# EAGLE design General IO (EAGLE 4.13)
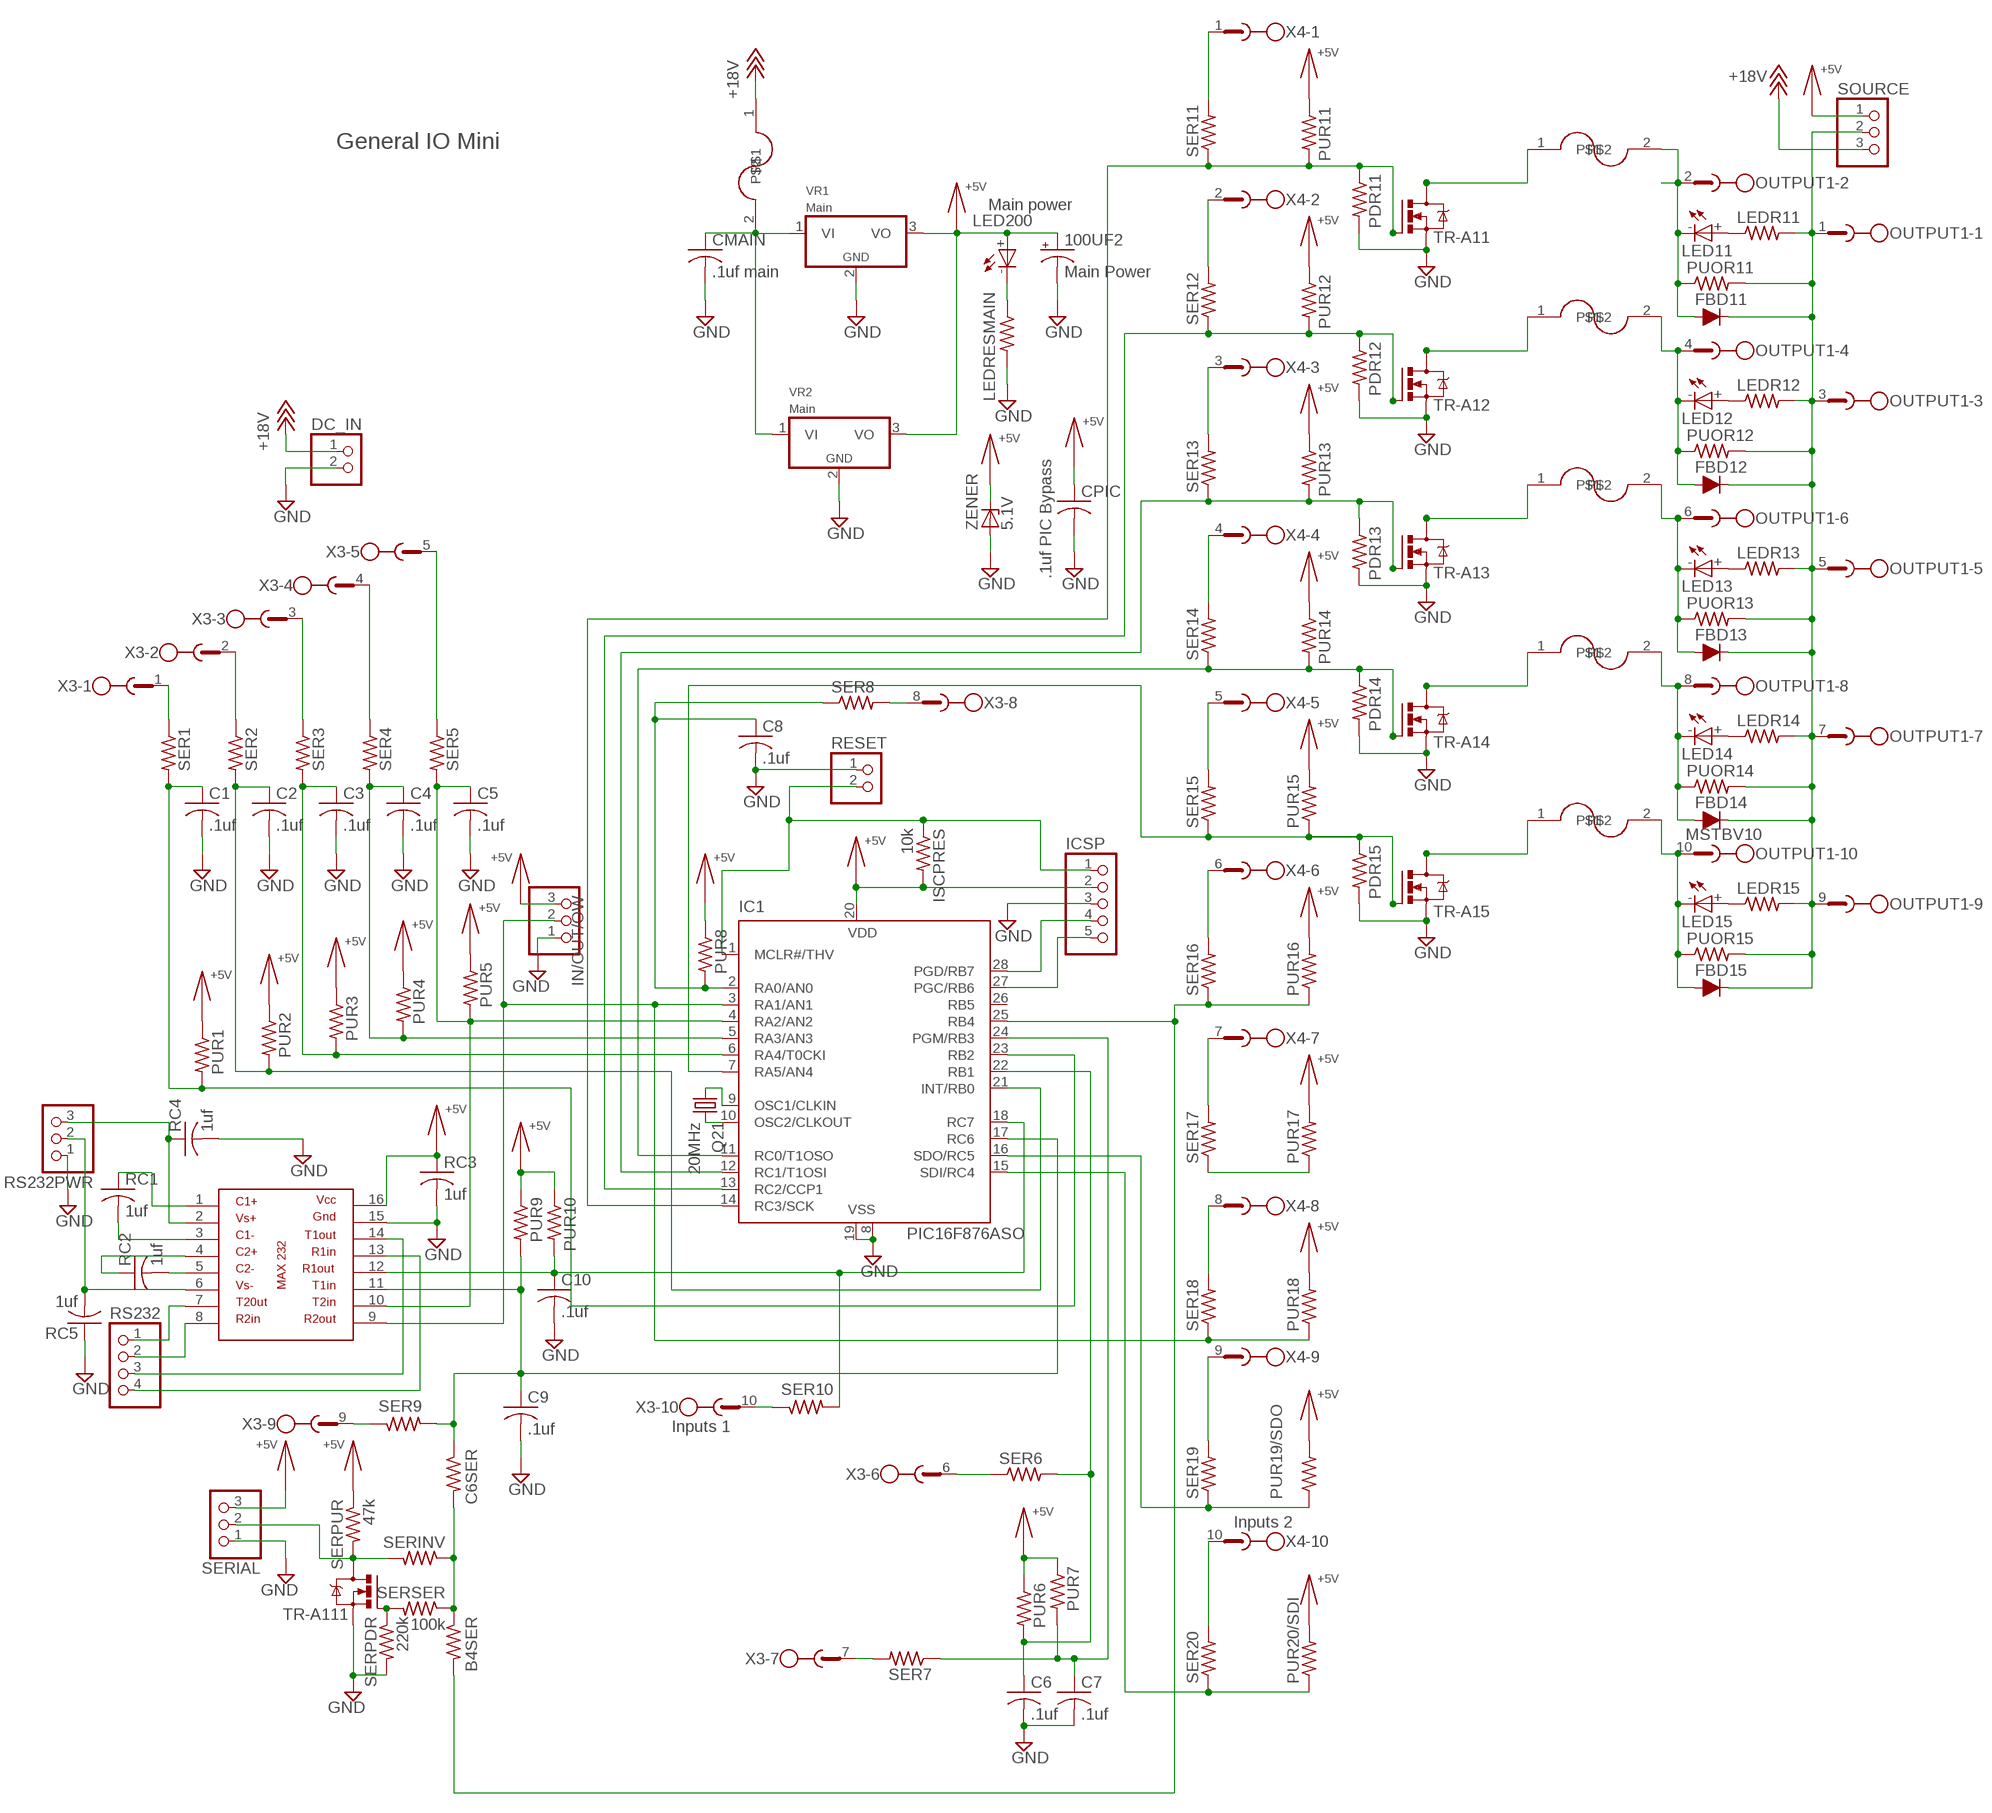
[diagram p0: schematic, sheet 1]

## Parts
100UF2  Main Power  CAPACITOR-ELECTROLYTICG  [PANASONIC_G]
B4SER  RESISITORM1406  [M1406]
C1  .1uf  CAPACITOR-NO-POLARITYC1210  [C1210]
C2  .1uf  CAPACITOR-NO-POLARITYC1210  [C1210]
C3  .1uf  CAPACITOR-NO-POLARITYC1210  [C1210]
C4  .1uf  CAPACITOR-NO-POLARITYC1210  [C1210]
C5  .1uf  CAPACITOR-NO-POLARITYC1210  [C1210]
C6  .1uf  CAPACITOR-NO-POLARITYC1210  [C1210]
C6SER  RESISITORM1406  [M1406]
C7  .1uf  CAPACITOR-NO-POLARITYC1210  [C1210]
C8  .1uf  CAPACITOR-NO-POLARITYC1210  [C1210]
C9  .1uf  CAPACITOR-NO-POLARITYC1210  [C1210]
C10  .1uf  CAPACITOR-NO-POLARITYC1210  [C1210]
CMAIN  .1uf main  CAPACITOR-NO-POLARITYC1210  [C1210]
CPIC  .1uf PIC Bypass  CAPACITOR-NO-POLARITYC1210  [C1210]
DC_IN  PINHD-1X2  [1X02]
FBD11  D-FILL-SOD-87  [SOD87]
FBD12  D-FILL-SOD-87  [SOD87]
FBD13  D-FILL-SOD-87  [SOD87]
FBD14  D-FILL-SOD-87  [SOD87]
FBD15  D-FILL-SOD-87  [SOD87]
IC1  PIC16F876ASO  PIC16F876SO  [SO-28W]
ICSP  PINHD-1X5  [1X05]
IN/OUT/OW  PINHD-1X3  [1X03]
ISCPRES  10k  RESISITORM1406  [M1406]
LED11  LED  [1206]
LED12  LED  [1206]
LED13  LED  [1206]
LED14  LED  [1206]
LED15  LED  [1206]
LED200  Main power  LED  [1206]
LEDR11  RESISITORM1406  [M1406]
LEDR12  RESISITORM1406  [M1406]
LEDR13  RESISITORM1406  [M1406]
LEDR14  RESISITORM1406  [M1406]
LEDR15  RESISITORM1406  [M1406]
LEDRESMAIN  RESISITORR1210  [R1210]
OUTPUT1  MSTBV10  [MSTBV10]
PDR11  RESISITORM1406  [M1406]
PDR12  RESISITORM1406  [M1406]
PDR13  RESISITORM1406  [M1406]
PDR14  RESISITORM1406  [M1406]
PDR15  RESISITORM1406  [M1406]
POLYFUSE11  POLYFUSE  [0204/5]
POLYFUSE12  POLYFUSE  [0204/5]
POLYFUSE13  POLYFUSE  [0204/5]
POLYFUSE14  POLYFUSE  [0204/5]
POLYFUSE15  POLYFUSE  [0204/5]
POLYFUSE200  Main power  POLYFUSE  [0204/5]
PUOR11  RESISITORM1406  [M1406]
PUOR12  RESISITORM1406  [M1406]
PUOR13  RESISITORM1406  [M1406]
PUOR14  RESISITORM1406  [M1406]
PUOR15  RESISITORM1406  [M1406]
PUR1  RESISITORM1406  [M1406]
PUR2  RESISITORM1406  [M1406]
PUR3  RESISITORM1406  [M1406]
PUR4  RESISITORM1406  [M1406]
PUR5  RESISITORM1406  [M1406]
PUR6  RESISITORM1406  [M1406]
PUR7  RESISITORM1406  [M1406]
PUR8  RESISITORM1406  [M1406]
PUR9  RESISITORM1406  [M1406]
PUR10  RESISITORM1406  [M1406]
PUR11  RESISITORM1406  [M1406]
PUR12  RESISITORM1406  [M1406]
PUR13  RESISITORM1406  [M1406]
PUR14  RESISITORM1406  [M1406]
PUR15  RESISITORM1406  [M1406]
PUR16  RESISITORM1406  [M1406]
PUR17  RESISITORM1406  [M1406]
PUR18  RESISITORM1406  [M1406]
PUR19/SDO  RESISITORM1406  [M1406]
PUR20/SDI  RESISITORM1406  [M1406]
Q21  20MHz  CRYSTALSM49  [SM49]
RC1  1uf  CAPACITOR-NO-POLARITYC1210  [C1210]
RC2  1uf  CAPACITOR-NO-POLARITYC1210  [C1210]
RC3  1uf  CAPACITOR-NO-POLARITYC1210  [C1210]
RC4  1uf  CAPACITOR-NO-POLARITYC1210  [C1210]
RC5  1uf  CAPACITOR-NO-POLARITYC1210  [C1210]
RESET  PINHD-1X2  [1X02]
RS232  PINHD-1X4  [1X04]
RS232PWR  PINHD-1X3  [1X03]
SER1  RESISITORM1406  [M1406]
SER2  RESISITORM1406  [M1406]
SER3  RESISITORM1406  [M1406]
SER4  RESISITORM1406  [M1406]
SER5  RESISITORM1406  [M1406]
SER6  RESISITORM1406  [M1406]
SER7  RESISITORM1406  [M1406]
SER8  RESISITORM1406  [M1406]
SER9  RESISITORM1406  [M1406]
SER10  RESISITORM1406  [M1406]
SER11  RESISITORM1406  [M1406]
SER12  RESISITORM1406  [M1406]
SER13  RESISITORM1406  [M1406]
SER14  RESISITORM1406  [M1406]
SER15  RESISITORM1406  [M1406]
SER16  RESISITORM1406  [M1406]
SER17  RESISITORM1406  [M1406]
SER18  RESISITORM1406  [M1406]
SER19  RESISITORM1406  [M1406]
SER20  RESISITORM1406  [M1406]
SERIAL  PINHD-1X3  [1X03]
SERINV  RESISITORM1406  [M1406]
SERPDR  220k  RESISITORM1406  [M1406]
SERPUR  47k  RESISITORM1406  [M1406]
SERSER  100k  RESISITORM1406  [M1406]
SOURCE  PINHD-1X3  [1X03]
TR-A11  ZXMN10A08GSOT223  [SOT223R_INFINEON]
TR-A12  ZXMN10A08GSOT223  [SOT223R_INFINEON]
TR-A13  ZXMN10A08GSOT223  [SOT223R_INFINEON]
TR-A14  ZXMN10A08GSOT223  [SOT223R_INFINEON]
TR-A15  ZXMN10A08GSOT223  [SOT223R_INFINEON]
TR-A111  ZXMN10A08GSOT223  [SOT223R_INFINEON]
U$1  MAX232  [SO16]
VR1  Main  VOLTAGE-REGULATOR  [TO220S]
VR2  Main  VOLTAGE-REGULATORSO-223  [SOT223R_INFINEON]
X3  Inputs 1  MSTBV10  [MSTBV10]
X4  Inputs 2  MSTBV10  [MSTBV10]
ZENER  5.1V  ZENER-DIODESMB  [SMB]

## Nets
$N199: IC1.15(SDI/RC4) PUR20/SDI.1 SER20.1
+5V: 100UF2.+ CPIC.1 IC1.20(VDD) ICSP.2 IN/OUT/OW.3 ISCPRES.2 LED200.+ PUR1.1 PUR2.1 PUR3.1 PUR4.1 PUR5.1 PUR6.1 PUR7.1 PUR8.1 PUR9.1 PUR10.1 PUR11.1 PUR12.1 PUR13.1 PUR14.1 PUR15.2 PUR16.2 PUR17.2 PUR18.2 PUR19/SDO.2 PUR20/SDI.2 RC3.1 SERIAL.3 SERPUR.1 SOURCE.1 U$1.16 VR1.3(VO) VR2.3(VO) ZENER.C
+18V: DC_IN.1 POLYFUSE200.1 SOURCE.3
GND: 100UF2.- C1.2 C2.2 C3.2 C4.2 C5.2 C6.2 C7.2 C8.2 C9.2 C10.2 CMAIN.2 CPIC.2 DC_IN.2 IC1.8(VSS) IC1.19(VSS) ICSP.3 IN/OUT/OW.1 LEDRESMAIN.2 PDR11.2 PDR12.2 PDR13.2 PDR14.2 PDR15.2 RC3.2 RC4.2 RC5.1 RESET.1 RS232PWR.1 SERIAL.1 SERPDR.2 TR-A11.3(S) TR-A12.3(S) TR-A13.3(S) TR-A14.3(S) TR-A15.3(S) TR-A111.3(S) U$1.15 VR1.2(GND) VR2.2(GND) ZENER.A
N$1: SER20.2 X4.10
N$3: SER17.2 X4.7
N$8: PUR17.1 SER17.1
N$11: IC1.16(SDO/RC5) PUR19/SDO.1 SER19.1
N$12: C8.1 IC1.2(RA0/AN0) PUR8.2 SER8.1
N$15: C2.1 IC1.21(INT/RB0) PUR2.2 SER2.2
N$16: FBD12.2(A) LED12.- OUTPUT1.4 POLYFUSE12.2 PUOR12.1
N$17: POLYFUSE15.1 TR-A15.2(D)
N$18: FBD15.2(A) LED15.- OUTPUT1.10 POLYFUSE15.2 PUOR15.1
N$19: RS232.1 U$1.7
N$20: SER16.2 X4.6
N$21: POLYFUSE14.1 TR-A14.2(D)
N$22: FBD14.2(A) LED14.- OUTPUT1.8 POLYFUSE14.2 PUOR14.1
N$23: POLYFUSE13.1 TR-A13.2(D)
N$24: FBD13.2(A) LED13.- OUTPUT1.6 POLYFUSE13.2 PUOR13.1
N$25: SER14.2 X4.4
N$26: SER12.2 X4.2
N$27: POLYFUSE12.1 TR-A12.2(D)
N$28: SER13.2 X4.3
N$29: POLYFUSE11.1 TR-A11.2(D)
N$30: FBD11.2(A) LED11.- OUTPUT1.2 POLYFUSE11.2 PUOR11.1
N$31: IC1.28(PGD/RB7) ICSP.4
N$32: SER15.2 X4.5
N$33: C1.1 IC1.23(RB2) PUR1.2 SER1.2
N$35: IC1.10(OSC2/CLKOUT) Q21.2
N$36: SERPDR.1 SERSER.2 TR-A111.1(G)
N$37: IC1.1(MCLR#/THV) ICSP.1 ISCPRES.1 RESET.2
N$38: SERIAL.2 SERINV.2 SERPUR.2 TR-A111.2(D)
N$39: IC1.9(OSC1/CLKIN) Q21.1
N$40: IC1.27(PGC/RB6) ICSP.5
N$41: C10.1 IC1.18(RC7) PUR10.2 SER10.2 U$1.12
N$42: SER9.1 X3.9
N$43: C5.1 IC1.4(RA2/AN2) PUR5.2 SER5.2 U$1.10
N$44: C6SER.1 C9.1 IC1.17(RC6) PUR9.2 SER9.2 U$1.11
N$45: RS232.2 U$1.8
N$49: RS232.3 U$1.14
N$52: FBD11.1(C) FBD12.1(C) FBD13.1(C) FBD14.1(C) FBD15.1(C) LEDR11.2 LEDR12.2 LEDR13.2 LEDR14.2 LEDR15.2 OUTPUT1.1 OUTPUT1.3 OUTPUT1.5 OUTPUT1.7 OUTPUT1.9 PUOR11.2 PUOR12.2 PUOR13.2 PUOR14.2 PUOR15.2 SOURCE.2
N$55: LED200.- LEDRESMAIN.1
N$60: RS232.4 U$1.13
N$63: CMAIN.1 POLYFUSE200.2 VR1.1(VI) VR2.1(VI)
N$71: LED15.+ LEDR15.1
N$72: LED14.+ LEDR14.1
N$73: LED13.+ LEDR13.1
N$74: LED12.+ LEDR12.1
N$75: LED11.+ LEDR11.1
N$77: SER3.1 X3.3
N$80: RC2.2 U$1.5
N$81: RC1.2 U$1.3
N$82: RC2.1 U$1.4
N$83: RC1.1 U$1.1
N$84: RC4.1 RS232PWR.3 U$1.2
N$85: RC5.2 RS232PWR.2 U$1.6
N$86: SER4.1 X3.4
N$87: SER5.1 X3.5
N$88: SER8.2 X3.8
N$89: SER1.1 X3.1
N$90: IC1.14(RC3/SCK) PDR11.1 PUR11.2 SER11.1 TR-A11.1(G)
N$91: SER2.1 X3.2
N$92: SER11.2 X4.1
N$93: IC1.13(RC2/CCP1) PDR12.1 PUR12.2 SER12.1 TR-A12.1(G)
N$94: IC1.12(RC1/T1OSI) PDR13.1 PUR13.2 SER13.1 TR-A13.1(G)
N$95: C4.1 IC1.5(RA3/AN3) PUR4.2 SER4.2
N$97: C3.1 IC1.6(RA4/T0CKI) PUR3.2 SER3.2
N$98: IC1.11(RC0/T1OSO) PDR14.1 PUR14.2 SER14.1 TR-A14.1(G)
N$99: B4SER.2 IC1.25(RB4) PUR16.1 SER16.1
N$100: SER19.2 X4.9
N$101: IC1.7(RA5/AN4) PDR15.1 PUR15.1 SER15.1 TR-A15.1(G)
N$102: SER18.2 X4.8
N$104: B4SER.1 C6SER.2 SERINV.1 SERSER.1
N$106: SER6.1 X3.6
N$107: C6.1 IC1.22(RB1) PUR6.2 SER6.2
N$108: SER7.2 X3.7
N$109: SER10.1 X3.10
N$111: C7.1 IC1.24(PGM/RB3) PUR7.2 SER7.1
SER18: IC1.3(RA1/AN1) IN/OUT/OW.2 PUR18.1 SER18.1 U$1.9
Unconnected: IC1.26(RB5)

## Notes on the sheet
- General IO Mini

## Library data of the parts
100UF2 = 1 Dan's Common Parts:CAPACITOR-ELECTROLYTIC: POLARIZED CAPACITOR, American symbol
B4SER C6SER ISCPRES LEDR11-LEDR15 LEDRESMAIN PDR11-PDR15 PUOR11-PUOR15 PUR1-PUR18 PUR19/SDO PUR20/SDI SER1-SER20 SERINV SERPDR SERPUR SERSER = 1 Dan's Common Parts:RESISITOR: RESISTOR, American symbol
C1-C10 CMAIN CPIC RC1-RC5 = 1 Dan's Common Parts:CAPACITOR-NO-POLARITY: CAPACITOR, American symbol
DC_IN RESET = pinhead:PINHD-1X2: PIN HEADER
FBD11-FBD15 = semicon-smd-ipc:D-FILL-: DIODE filled
IC1 = 1 Dan's Common Parts:PIC16*876: MICROCONTROLLER flash type
ICSP = pinhead:PINHD-1X5: PIN HEADER
IN/OUT/OW RS232PWR SERIAL SOURCE = pinhead:PINHD-1X3: PIN HEADER
LED11-LED15 LED200 = 1 Dan's Common Parts:LED
OUTPUT1 X3 X4 = con-phoenix-508:MSTBV10: PHOENIX
POLYFUSE11-POLYFUSE15 POLYFUSE200 = 1 Dan's Common Parts:POLYFUSE
Q21 = 1 Dan's Common Parts:CRYSTAL: CRYSTAL
RS232 = pinhead:PINHD-1X4: PIN HEADER
TR-A11-TR-A15 TR-A111 = 1 Dan's Common Parts:ZXMN10A08G: N-CHANNEL MOS FET
U$1 = 1 Dan's Common Parts:MAX232
VR1 VR2 = 1 Dan's Common Parts:VOLTAGE-REGULATOR: Positive VOLTAGE REGULATOR Source: http://cache.national.com/ds/LM/LM78L05.pdf http://www.fairchildsemi.com/ds/LM/LM7805.pdf
ZENER = 1 Dan's Common Parts:ZENER-DIODE: Z-Diode

## Board
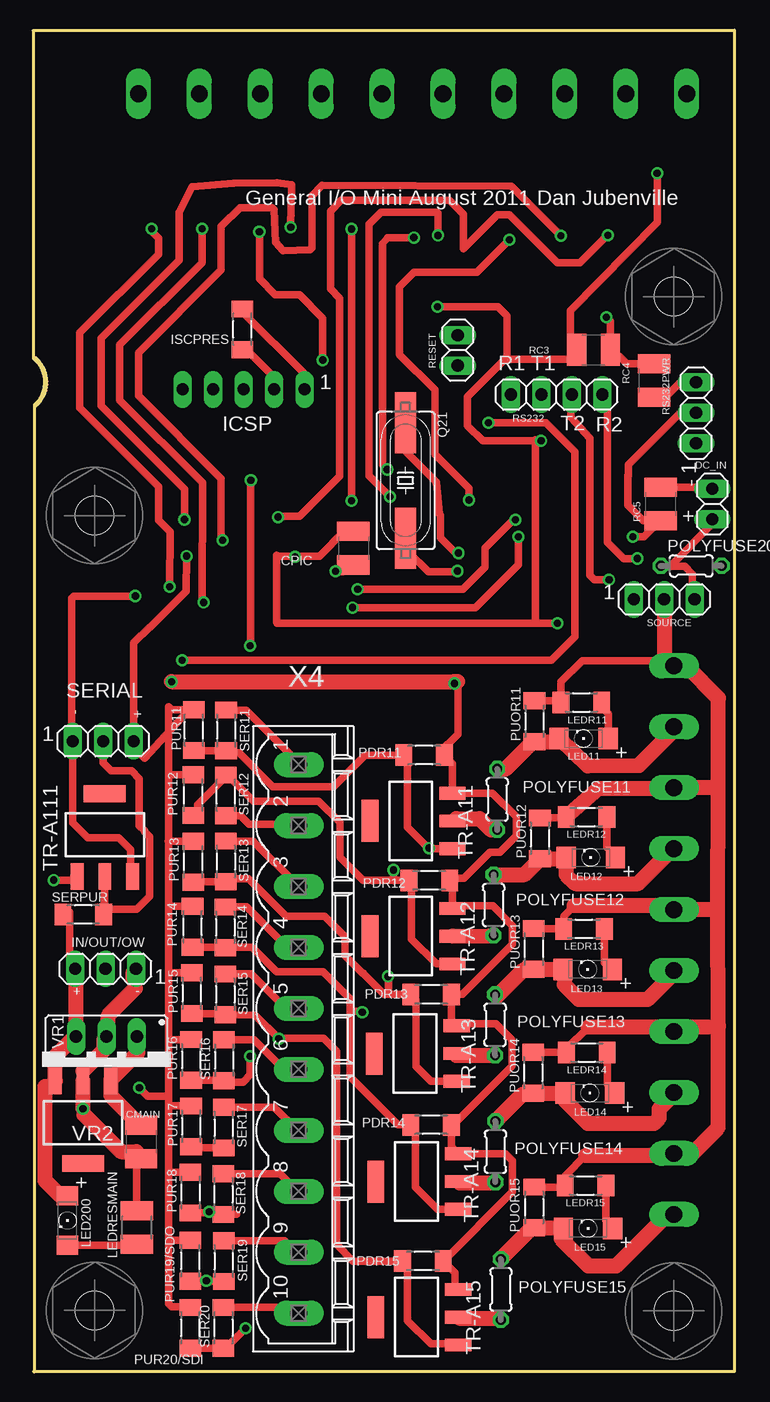
[diagram p1: board, top side]
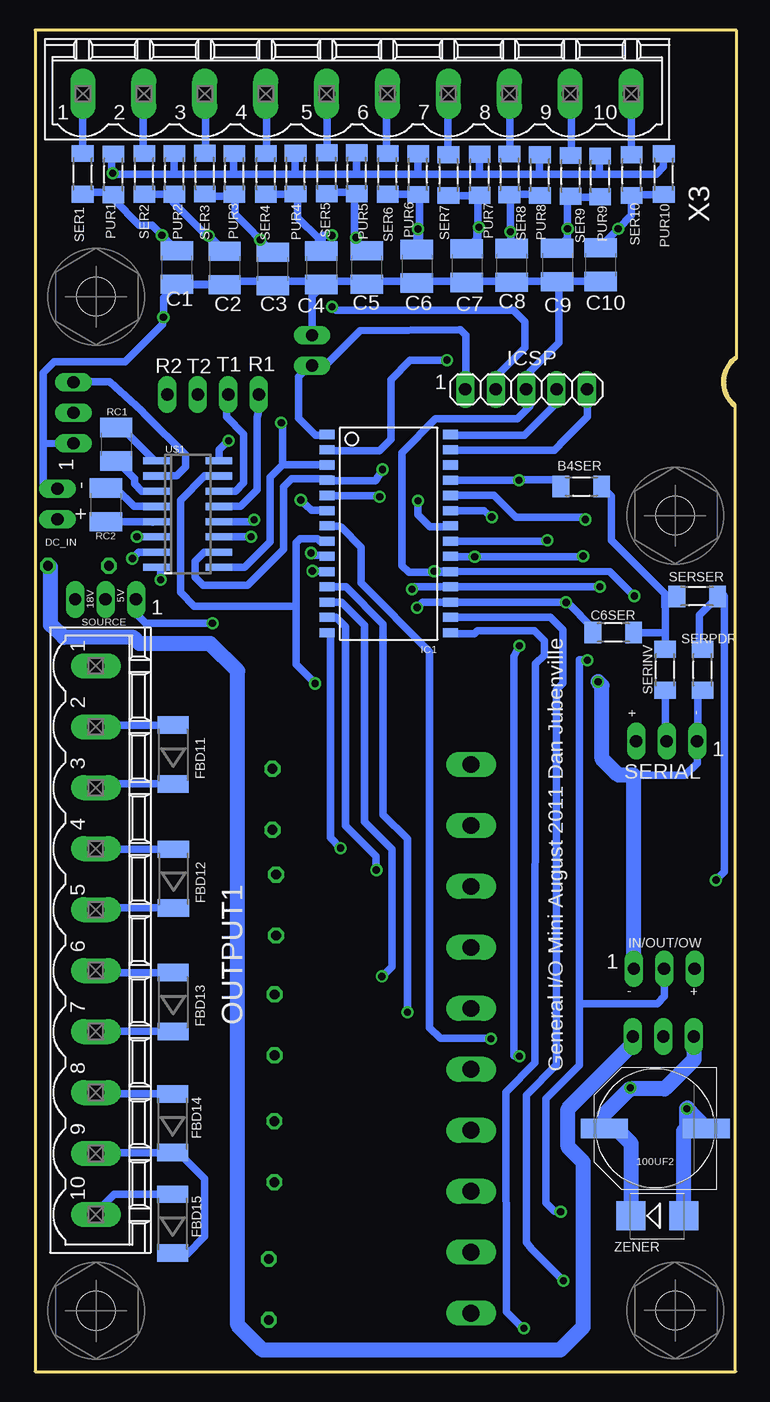
[diagram p2: board, bottom side, seen from below]

Size 58.5 x 111.81 mm. Coordinates in mm from the lower left corner, seen from the top.
Outline: 0.05,111.78 58.5,111.81 58.5,0 0.13,0
Outline: 0.2,80.54 arc100 0.13,84.45
Outline: 0,111.78 0.03,111.78 0.03,84.45
Outline: 0.05,0 0.13,0
Outline: 0.13,0 0.13,80.57
Copper layers (1*16): Top 0.035mm / dielectric 1.5mm / Bottom 0.035mm
Design rules "default": minimum track width 15mil, minimum drill 20mil, track to track 15mil, track to pad 15mil, pad to pad 15mil, via to via 15mil, smd to smd 0mil, copper to edge 5mil, drill to drill 5mil, minimum pad ring 10mil, minimum via ring 8mil, stop-mask expansion 4mil, vias tented up to drill 0mil, thermal gap 10mil

### Footprints (pad centres in the part's own frame; a part is rotated, then mirrored left to right if it is on the bottom)
PANASONIC_G = smd 3.9 x 1.6: + 4.25,0; - -4.25,0
M1406 = smd 1.4 x 1.8: 1 -1.7,0; 2 1.7,0
C1210 = smd 1.6 x 2.7: 1 -1.4,0; 2 1.4,0
1X02 = drill 1.016 long: 1 -1.27,0; 2 1.27,0
SOD87 = smd 1.45 x 2.6: 1 -2.445,0; 2 2.445,0
SO-28W = smd 0.762 x 1.27: 1 -7.62,-5.207; 2 -6.35,-5.207; 3 -5.08,-5.207; 4 -3.81,-5.207; 5 -2.54,-5.207; 6 -1.27,-5.207; 7 0,-5.207; 8 1.27,-5.207; 9 2.54,-5.207; 10 3.81,-5.207; 11 5.08,-5.207; 12 6.35,-5.207; 13 7.62,-5.207; 14 8.89,-5.207; 15 8.89,5.08; 16 7.62,5.08; 17 6.35,5.08; 18 5.08,5.08; 19 3.81,5.08; 20 2.54,5.08; 21 1.27,5.08; 22 0,5.08; 23 -1.27,5.08; 24 -2.54,5.08; 25 -3.81,5.08; 26 -5.08,5.08; 27 -6.35,5.08; 28 -7.62,5.08
1X05 = drill 1.016 long: 1 -5.08,0; 2 -2.54,0; 3 0,0; 4 2.54,0; 5 5.08,0
1X03 = drill 1.016 long: 1 -2.54,0; 2 0,0; 3 2.54,0
1206 = smd 1.6 x 1.803: + -1.422,0; - 2.692,0
R1210 = smd 1.6 x 2.7: 1 -1.4,0; 2 1.4,0
MSTBV10 = drill 1.397 long: 1 -22.86,0; 2 -17.78,0; 3 -12.7,0; 4 -7.62,0; 5 -2.54,0; 6 2.54,0; 7 7.62,0; 8 12.7,0; 9 17.78,0; 10 22.86,0
0204/5 = drill 0.813 octagon: 1 -2.54,0; 2 2.54,0
SM49 = smd 5.08 x 1.778: 1 -4.826,0; 2 4.826,0
1X04 = drill 1.016 long: 1 -3.81,0; 2 -1.27,0; 3 1.27,0; 4 3.81,0
SOT223R_INFINEON = smd 1.067 x 2.184: 1 -2.311,-3.479; 2 0,-3.48; 3 2.312,-3.48 | smd 3.5 x 1.4: 4 0,3.404
SO16 = smd 0.6 x 2.2: 1 -4.445,-2.6; 2 -3.175,-2.6; 3 -1.905,-2.6; 4 -0.635,-2.6; 5 0.635,-2.6; 6 1.905,-2.6; 7 3.175,-2.6; 8 4.445,-2.6; 9 4.445,2.6; 10 3.175,2.6; 11 1.905,2.6; 12 0.635,2.6; 13 -0.635,2.6; 14 -1.905,2.6; 15 -3.175,2.6; 16 -4.445,2.6
SCREW = hole 3.2: 0,0
TO220S = drill 1.016 long: 1 -2.54,-2.54; 2 0,-2.54; 3 2.54,-2.54
SMB = smd 2.4 x 2.4: A 2.2,0; C -2.2,0

### Placement (x,y rotation side)
100UF2  6.78,20.27 180 bottom
B4SER  12.95,73.76 180 bottom
C1  46.69,92.02 270 bottom
C2  42.7,91.97 270 bottom
C3  38.68,91.9 270 bottom
C4  34.62,92 270 bottom
C5  30.86,92.02 270 bottom
C6  26.67,92.13 270 bottom
C6SER  10.29,61.59 0 bottom
C7  22.5,92.18 270 bottom
C8  18.77,92.2 270 bottom
C9  14.96,92.23 270 bottom
C10  11.35,92.25 270 bottom
CMAIN  9.02,19.15 270 top
CPIC  26.72,68.63 270 top
DC_IN  56.64,72.31 90 top
FBD11  46.99,51.44 90 bottom
FBD12  46.96,41.1 90 bottom
FBD13  46.99,30.81 90 bottom
FBD14  47.04,20.7 90 bottom
FBD15  47.04,12.34 90 bottom
IC1  28.96,70.48 270 bottom
ICSP  17.55,81.86 0 bottom
IN/OUT/OW  6.05,33.58 180 top
ISCPRES  17.45,86.87 270 top
LED11  46.53,52.76 180 top
LED12  47.14,42.85 180 top
LED13  46.89,33.53 180 top
LED14  47.07,23.22 180 top
LED15  46.91,11.94 180 top
LED200  2.87,13.23 270 top
LEDR11  45.72,55.78 180 top
LEDR12  46.15,46.23 180 top
LEDR13  45.95,36.91 180 top
LEDR14  46.18,26.59 180 top
LEDR15  46.08,15.52 180 top
LEDRESMAIN  8.66,12.01 90 top
OUTPUT1  53.44,35.97 270 bottom
PDR11  32.61,51.38 0 top
PDR12  33.05,40.94 0 top
PDR13  33.2,31.45 0 top
PDR14  33.2,20.57 0 top
PDR15  32.51,9.22 0 top
POLYFUSE11  38.71,47.7 90 top
POLYFUSE12  38.4,38.89 90 top
POLYFUSE13  38.53,28.91 90 top
POLYFUSE14  38.56,18.34 90 top
POLYFUSE15  39.01,6.86 90 top
POLYFUSE200  54.89,67.16 0 top
PUOR11  41.81,54.2 90 top
PUOR12  42.27,44.45 90 top
PUOR13  41.76,35.23 90 top
PUOR14  41.71,24.92 90 top
PUOR15  41.78,13.69 90 top
PUR1  51.97,99.77 270 bottom
PUR2  46.89,99.82 270 bottom
PUR3  41.88,99.82 270 bottom
PUR4  36.78,99.85 270 bottom
PUR5  31.67,99.87 270 bottom
PUR6  26.57,99.8 270 bottom
PUR7  21.44,99.75 270 bottom
PUR8  16.41,99.72 270 bottom
PUR9  11.38,99.62 270 bottom
PUR10  6.07,99.8 270 bottom
PUR11  13.41,53.47 270 top
PUR12  13.36,48.06 270 top
PUR13  13.36,42.49 270 top
PUR14  13.31,37.08 270 top
PUR15  13.23,31.55 90 top
PUR16  13.18,25.98 90 top
PUR17  13.18,20.45 90 top
PUR18  13.13,14.94 90 top
PUR19/SDO  13.11,9.25 90 top
PUR20/SDI  13.11,3.66 90 top
Q21  31.06,74.27 270 top
RC1  51.74,77.29 270 bottom
RC2  52.6,72.24 270 bottom
RC3  46.74,85.17 0 top
RC4  51.79,82.6 90 top
RC5  52.32,72.31 270 top
RESET  35.41,85.12 270 top
RS232  43.66,81.43 180 top
RS232PWR  55.3,79.91 90 top
SER1  54.53,99.82 270 bottom
SER2  49.4,99.82 270 bottom
SER3  44.35,99.85 270 bottom
SER4  39.27,99.82 270 bottom
SER5  34.19,99.87 270 bottom
SER6  29.11,99.82 270 bottom
SER7  24.03,99.72 90 bottom
SER8  18.95,99.77 90 bottom
SER9  13.84,99.64 270 bottom
SER10  8.76,99.72 270 bottom
SER11  16.1,53.44 90 top
SER12  16.08,48.03 270 top
SER13  16.08,42.52 90 top
SER14  16.03,37.03 90 top
SER15  16.03,31.45 90 top
SER16  15.93,25.96 90 top
SER17  15.9,20.35 90 top
SER18  15.88,14.81 90 top
SER19  15.9,9.22 90 top
SER20  15.88,3.66 90 top
SERIAL  5.84,52.55 0 top
SERINV  5.97,58.5 270 bottom
SERPDR  2.84,58.5 270 bottom
SERPUR  4.19,38.1 0 top
SERSER  3.3,64.62 0 bottom
SOURCE  52.63,64.36 0 top
TR-A11  31.5,45.9 90 top
TR-A12  31.5,36.3 90 top
TR-A13  31.85,26.52 90 top
TR-A14  31.98,15.85 90 top
TR-A15  31.98,4.55 90 top
TR-A111  5.99,44.75 0 top
U$1  45.77,71.48 270 bottom
U$11  [SCREW]  5.13,5.11 0 top
U$13  [SCREW]  5.13,71.35 0 top
U$14  [SCREW]  53.42,5.08 0 top
U$15  [SCREW]  53.42,89.59 0 top
VR1  6.12,25.4 180 top
VR2  4.17,20.75 180 top
X3  31.65,106.5 0 bottom
X4  22.15,27.74 270 top
ZENER  6.62,12.99 0 bottom

### Tracks (layer width: path | path; a pad name or v marks a point on that pad's centre or on a via)
$N199  (via drill 0.6)
  Top 0.61: PUR20/SDI.1 SER20.1 | SER20.1 15.9,1.96 15.95,2.01 | 15.9,1.8 15.9,1.93 SER20.1 | 15.9,1.8 v17.73,3.63 | 15.9,1.8 15.9,1.73
  Bottom 0.61: 17.73,3.73 v17.73,3.63 17.78,3.63 17.81,3.61 19.2,5 19.25,23.29 16.82,25.73 16.76,58.98 16.05,59.69 16.05,60.94 16.87,61.75 21.62,61.75 21.87,61.49 23.9,61.49 24,61.59 | 24,61.59 24.03,61.62 | 24,61.59 IC1.15
+5V  (via drill 0.6)
  Top 0.61: 13.54,55.17 13.56,55.19 13.51,55.24 | 13.54,55.17 PUR11.1 13.44,55.17 13.49,55.22 13.26,55.45 9.3,51.1 8.41,52.05 8.41,54.56 | CPIC.1 25.94,70.03 23.88,67.97 21.9,67.97 v21.84,67.92 21.84,67.97 20.37,67.97 20.29,68.05 20.29,62.46 20.37,62.38 41.91,62.38 | SERPUR.1 2.87,38.33 3.05,38.28 3.05,33.91 3.43,33.53 | 3.43,33.53 3.48,33.58 IN/OUT/OW.3 | v33.73,88.75 38.76,88.75 39.5,88.01 39.5,84.38 39.47,84.35 39.47,84.38 | v52.04,99.87 52.04,95.81 44.8,88.43 44.8,86.32 45.34,85.8 RC3.1 45.44,85.17 | SERIAL.3 8.43,52.55 8.41,54.56 | 8.41,54.56 8.41,60.73 9.73,62.05 9.78,62.05 12.75,65.02 v12.8,67.97 | 13.54,55.17 11.56,55.17 11.3,55.42 11.3,49.73 | 11.3,10.95 11.3,5.66 11.56,5.41 13.08,5.41 13.13,5.36 | 11.3,16.74 11.3,10.95 | 11.3,22 11.3,16.74 | 11.3,22.96 11.3,22.17 11.33,22.15 PUR17.2 13.18,22.17 11.48,22.17 11.3,22 | 11.3,22.96 11.3,27.86 | 11.3,27.86 11.3,33.27 | 11.3,33.27 11.3,38.79 | 11.3,38.79 11.3,44.22 | 11.3,44.22 11.3,49.73 | 13.13,5.36 13.23,5.26 | 13.13,5.36 PUR20/SDI.2 | 11.3,10.95 11.33,10.95 PUR19/SDO.2 | PUR18.2 11.41,16.64 11.3,16.74 | 11.3,38.79 11.38,38.79 11.38,38.78 PUR14.1 | 11.3,44.22 11.25,44.22 11.28,44.19 PUR13.1 | 11.3,49.73 11.33,49.73 11.35,49.76 PUR12.1 | 11.3,33.27 11.33,33.27 11.36,33.25 PUR15.2 | 11.3,27.86 11.33,27.86 11.51,27.68 PUR16.2 | 3.61,27.91 VR1.3 3.51,27.94 | 3.61,33.35 3.43,33.53 | 1.78,23.77 1.85,24.05 VR2.3 | 2.26,14.68 2.87,14.63 LED200.+ | 11.3,22.96 11.3,22 | 11.3,22.96 9.55,22.96 v8.86,23.67 | ISCPRES.2 17.5,85.17 17.65,85.32 19.99,82.98 ICSP.2 | 41.91,62.38 v43.71,62.38 | 45.44,85.17 45.49,85.22 | 39.47,84.38 44.65,84.38 45.44,85.17 | 39.47,84.38 39.37,84.38 36.25,81.25 36.25,78.84 37.52,77.57 v42.37,77.57 41.99,77.57 41.91,77.65 41.91,62.38
  Top 1.27: 3.61,27.91 3.61,33.35 | VR2.3 1.85,26.29 3.51,27.94 | 1.78,23.77 1.02,23.77 1.02,15.93 2.26,14.68
  Bottom 0.61: PUR10.1 6.1,101.47 6.1,100.41 6.71,99.8 11.43,99.8 | 46.91,99.8 51.84,99.8 51.94,99.9 | 46.91,99.8 41.94,99.8 | 41.94,99.8 36.83,99.8 | 36.83,99.8 31.7,99.8 | 31.7,99.8 26.59,99.8 | 26.59,99.8 21.44,99.8 | 21.44,99.8 16.43,99.8 | 16.43,99.8 11.43,99.8 | PUR1.1 52.09,101.35 52.1,101.35 52.1,100.05 51.94,99.9 | PUR2.1 46.91,101.5 46.91,99.8 | PUR3.1 41.94,101.47 41.94,99.8 | PUR4.1 36.83,101.5 36.83,99.8 | PUR5.1 31.7,101.55 31.7,99.8 | PUR6.1 26.59,101.47 26.59,99.8 | 21.44,99.8 PUR7.1 | PUR8.1 16.43,101.39 16.43,99.8 | PUR9.1 11.43,101.27 11.43,99.8 | IC1.20 23.85,67.94 23.83,67.92 v21.84,67.92 12.8,67.92 v12.8,67.97 | 51.94,99.9 52.04,99.8 v52.04,99.87 | 11.06,21.43 100UF2.+ 11.74,20.45 | 8.76,23.57 8.92,23.57 | 3.56,27.84 3.58,27.86 VR1.3 | 11.74,20.45 11.84,20.52 | 11.74,20.45 11.66,20.45 | 8.76,23.57 8.76,23.55 | v8.86,23.67 8.76,23.75 8.76,23.57 | SOURCE.1 50.14,64.41 50.11,63.22 49.28,62.38 v43.71,62.38 | 42.37,77.62 42.34,77.65 | v42.37,77.57 42.37,77.62 | U$1.16 43.17,76.82 42.37,77.62 | ICSP.2 20.02,82.96 17.65,85.34 17.65,87.5 18.62,88.47 33.4,88.47 33.71,88.88 v33.73,88.75
  Bottom 1.27: 8.92,23.57 11.06,21.43 | 8.76,23.57 5.99,23.57 3.56,26.01 3.56,27.84 | ZENER.C 8.82,19.03 10.19,20.4 11.66,20.45
+18V
  Top 0.61: DC_IN.1 56.64,70.84 56.74,70.74 53.09,67.08 52.38,67.08 52.38,67.13 POLYFUSE200.1 52.35,67.13 54.33,67.13 54.99,66.47 54.99,64.54 SOURCE.3
GND  (via drill 0.6)
  Top 0.61: 8.31,41.2 8.36,41.15 | 8.31,41.2 TR-A111.3 | 8.31,41.2 8.15,41.35 8.15,43.48 7.14,44.5 4.55,44.5 3.3,45.74 SERIAL.1 3.3,52.45 3.28,52.43 3.23,52.48 3.23,64.47 3.4,64.64 v8.53,64.64 | 27.38,67.69 26.92,67.23 CPIC.2 26.72,67.21 26.24,66.73 25.86,66.65 25.1,66.65 v25.22,66.7 | TR-A15.3 35.36,6.76 35.2,6.76 35.2,8.23 PDR15.2 39.98,14.99 39.98,17.58 39.4,18.16 TR-A14.3 | TR-A14.3 35.33,18.16 | TR-A14.3 34.87,18.75 34.87,20.57 PDR14.2 35.05,20.57 39.93,25.45 39.93,27.66 38.61,28.98 35.48,28.98 TR-A13.3 | TR-A13.3 35.13,28.63 | TR-A13.3 35.26,28.83 34.9,29.19 PDR13.2 35.81,31.45 39.98,35.61 39.98,37.19 38.35,38.81 35.15,38.81 34.95,38.61 | 34.95,38.61 34.87,38.53 | 34.95,38.61 TR-A12.3 34.98,40.64 34.67,40.95 | 34.67,40.95 34.65,40.97 | 34.67,40.95 PDR12.2 34.93,41.12 35.94,41.12 38.1,43.28 38.94,43.28 40.31,44.65 40.31,46.23 38.33,48.21 TR-A11.3 34.98,50.67 34.26,51.38 PDR11.2 34.29,51.38 34.21,51.31 33.91,51.61 35.43,53.14 35.43,57.51 | 8.36,33.35 IN/OUT/OW.1 | 8.53,32.49 8.36,32.66 | 6.27,27.99 6.17,27.99 VR1.2 6.12,27.96 | VR2.2 4.17,25.07 | 6.12,27.96 6.17,28.02 | 5.94,27.79 6.12,27.96 | LEDRESMAIN.2 8.66,17.68 8.84,17.86 8.94,17.75 CMAIN.2 9.09,17.75 9.14,17.8 8.61,18.34 | v4.17,21.92 3.99,21.74 4.27,21.41 | 35.1,57.51 35.1,57.35 v35.15,57.35 | DC_IN.2 56.64,73.61 56.54,73.71 RC5.1 | RC4.2 49.5,84 48.16,85.34 48.14,85.32 RC3.2 48.14,87.55 v47.8,87.88
  Top 1.27: 8.36,32.66 8.36,33.35 | 8.53,32.49 8.53,31.95 6.27,29.69 6.27,27.99 | 4.17,25.07 5.94,26.85 5.94,27.79 | v4.17,21.92 VR2.2 | 4.27,21.41 7.34,18.34 8.61,18.34 | v11.56,57.51 35.1,57.51 35.43,57.51
  Bottom 0.61: 11.33,90.88 11.05,90.88 11.15,90.78 11.84,90.78 | 11.33,90.88 C10.2 | 38.91,90.88 42.14,90.88 | 42.14,90.88 42.36,90.88 | 33.99,90.88 38.91,90.88 | 30.28,90.88 33.99,90.88 | 26.31,90.88 30.28,90.88 | 22.45,90.88 26.31,90.88 | 18.14,90.88 22.45,90.88 | 14.45,90.88 14.88,90.88 | 14.88,90.88 18.14,90.88 | 14.45,90.88 11.33,90.88 | C3.2 38.91,90.73 38.91,90.88 | 33.99,90.88 33.99,90.7 34.52,90.7 C4.2 34.62,90.45 35.41,89.64 RESET.1 | 30.28,90.88 30.28,90.6 30.84,90.6 C5.2 31.01,90.78 31.01,90.83 | 26.31,90.88 26.31,90.65 26.6,90.65 C6.2 | 22.45,90.88 22.45,90.73 | 22.45,90.73 C7.2 | 22.45,90.73 22.45,90.7 | 18.14,90.88 18.14,90.6 18.57,90.6 C8.2 | 14.45,90.88 14.45,90.7 14.84,90.7 | 14.84,90.7 C9.2 14.94,90.83 14.88,90.88 | 23.77,66.73 23.83,66.67 23.85,66.67 | 46.97,90.57 C2.2 | 46.97,90.57 47.02,90.53 | 42.14,90.88 42.14,90.63 42.14,90.62 C1.2 | 3.25,52.5 3.25,52.48 | 23.83,66.62 23.7,66.62 | 23.83,66.62 IC1.19 23.85,66.67 | 23.83,66.62 27.33,66.62 27.89,67.18 27.89,76.15 | 27.89,76.15 27.89,76.3 | 14.88,90.88 14.99,90.78 | v8.53,64.64 10.57,66.67 v25.22,66.7 23.83,66.7 23.85,66.67 | 4.11,21.96 4.12,21.97 | 4.12,20.27 4.17,20.22 | 100UF2.- 4.11,20.34 4.12,20.34 4.42,20.05 | IC1.8 34.75,69.22 34.95,69.42 36.4,69.42 36.73,69.09 36.73,69.04 36.73,63.8 | 36.73,63.27 36.73,58.95 v35.15,57.35 | 36.73,63.27 36.73,63.8 | U$1.15 44.37,74.65 46.38,72.64 46.38,64.95 45.24,63.8 36.73,63.8 | 36.73,63.27 36.73,63.3 36.73,63.27 | C1.2 47.8,89.51 v47.8,87.88 47.8,87.91 | 8.59,49.71 4.32,49.71 3.3,50.72 SERIAL.1 | SERIAL.1 3.3,52.6 | DC_IN.2 56.74,73.58 57.81,73.76 57.81,77.34 | 57.81,77.34 RS232PWR.1 | 36.73,63.8 | 46.97,90.57 46.92,90.62 C1.2
  Bottom 0.61: 3.25,52.5 3.25,52.17 | SERIAL.1 3.25,52.5 | SERPDR.2 3.25,56.39 3.25,52.5 | 17.22,83.34 17.25,83.34 14.84,85.75 14.84,90.7 | 17.7,81.28 ICSP.3 17.55,82.09 17.48,82.17 17.25,81.94 17.25,80.44 18.29,79.4 25.1,79.4 27.89,76.58 27.89,76.15 | 17.7,81.28 17.22,83.34 | 17.22,83.34 17.25,82.02 | 17.3,81.2 17.4,81.23 17.4,81.46 17.37,81.48 17.55,81.66 17.55,81.79 17.7,81.64 17.7,81.28 | 57.81,77.34 57.81,83.24 56.9,84.18 50.98,84.18 47.88,87.27 47.88,87.83 47.8,87.91 | 47.8,87.91 47.78,87.94
  Bottom 1.27: 4.11,21.96 100UF2.- 4.12,20.27 | 4.17,20.22 v4.17,21.92 | ZENER.A 4.42,20.05 | IN/OUT/OW.1 8.59,49.71 9.86,49.71 11.23,51.08 11.23,57.17 v11.56,57.51
N$1
  Top 0.61: X4.10 22.07,4.88 21.59,5.36 SER20.2
N$3
  Top 0.61: X4.7 22.05,20.12 20.12,22.05 SER17.2
N$8
  Top 0.61: PUR17.1 13.18,18.77 13.21,18.8 13.36,18.64 SER17.1
N$11  (via drill 0.6)
  Top 0.61: 15.98,7.52 16.03,7.47 | 15.98,7.52 SER19.1 | 15.98,7.52 15.95,7.55 PUR19/SDO.1 13.13,7.57 v14.45,7.57
  Bottom 0.61: v14.45,7.57 17.09,10.21 17.55,10.77 17.55,23.04 15.01,25.58 15.01,56.84 14.5,57.35 14.5,61.82 15.55,62.87 IC1.16
N$12  (via drill 0.6)
  Top 0.61: v18.87,95 18.87,91.08 20.19,89.76 22.23,89.76 24.16,87.81 v24.16,84.3
  Bottom 0.61: 18.9,98.12 18.87,98.12 v18.87,95 C8.1 | PUR8.2 16.48,98.1 16.48,98.12 18.9,98.12 | 18.9,98.12 SER8.1 | IC1.2 34.11,76.89 33.96,76.73 29.79,76.73 28.83,77.7 28.83,82.68 27.23,84.28 24,84.3 v24.16,84.3
N$15  (via drill 0.6)
  Top 0.61: v44.02,94.67 39.88,98.81 24.1,98.86 23.27,98.02 23.27,93.65 23.11,93.5 20.85,93.4 20.24,94.11 20.09,96.83 19.91,97 17.25,97 15.7,95.45 15.7,91.82 8.79,84.91 8.79,81.33 15.7,74.42 15.7,69.39 v15.8,69.29
  Bottom 0.61: SER2.2 PUR2.2 46.99,98.02 46.99,97.46 43.56,94.03 43.36,94.03 C2.1 43.99,94.67 v44.02,94.67 | IC1.21 15.75,69.22 15.75,69.29 v15.8,69.29
N$16
  Top 0.61: 42.27,42.7 PUOR12.1 | LED12.- 44.53,42.77 44.5,42.75 | 53.39,43.61 53.42,43.59 OUTPUT1.4
  Top 1.27: POLYFUSE12.2 41,41.43 42.27,42.7 | PUOR12.1 44.5,42.75 | LED12.- 44.45,41.43 45.21,40.66 50.44,40.66 53.39,43.61
  Bottom 0.61: OUTPUT1.4 53.44,43.71 53.27,43.54 FBD12.2
N$17
  Top 0.61: 38.96,4.47 38.96,4.37 POLYFUSE15.1 | TR-A15.2 35.54,4.47
  Top 1.27: 35.54,4.47 38.96,4.47
N$18
  Top 0.61: 41.66,12.12 41.66,12.17 | 41.66,12.12 PUOR15.1 | 41.66,12.04 41.66,12.12 | 43.92,11.99 44.17,12.24 44.22,12.19 LED15.- 44.2,11.94 44.07,12.06 44.02,12.01 44.02,11.1
  Top 1.27: POLYFUSE15.2 41.66,12.04 | PUOR15.1 43.92,11.99 | OUTPUT1.10 52.93,13.11 48.64,8.81 46.3,8.81 44.02,11.1
  Bottom 0.61: 53.59,13.11 53.62,13.08 | OUTPUT1.10 53.59,13.11 | FBD15.2 46.94,14.81 51.89,14.81 53.59,13.11
N$19  (via drill 0.6)
  Top 0.61: v50.39,67.77 49.25,67.77 47.9,69.11 47.9,80.59 47.45,81.23 RS232.1
  Bottom 0.61: U$1.7 49.86,68.3 v50.39,67.77
N$20
  Top 0.61: SER16.2 18.44,27.66 20.9,25.2 22.1,25.2 22.12,25.17 X4.6
N$21
  Top 0.61: 38.61,15.75 POLYFUSE14.1 | TR-A14.2 35.56,15.75
  Top 1.27: 35.56,15.75 38.61,15.75
N$22
  Top 0.61: PUOR14.1 41.6,23.11 40.79,23.11 | 44.6,23.24 44.58,23.22 LED14.- 44.37,22.58 | 53.49,23.16 53.44,23.22 OUTPUT1.8
  Top 1.27: POLYFUSE14.2 40.79,23.11 | PUOR14.1 44.58,23.22 | 44.37,22.58 46.25,20.7 51.79,20.7 52.22,21.13 52.22,21.89 53.49,23.16
  Bottom 0.61: OUTPUT1.8 53.44,23.22 53.47,23.19 53.42,23.15 FBD14.2
N$23
  Top 0.61: TR-A13.2 35.33,26.44 35.28,26.39 35.31,26.36
  Top 1.27: 35.31,26.36 POLYFUSE13.1
N$24
  Top 0.61: 44.2,33.38 44.3,33.27 | 44.2,33.38 LED13.- | 44.04,33.53 44.2,33.38 | 38.61,31.45 38.74,31.32 | 40.95,33.53 PUOR13.1 | 53.67,33.45 53.65,33.43 OUTPUT1.6
  Top 1.27: PUOR13.1 44.04,33.53 | POLYFUSE13.2 38.61,31.45 | 38.74,31.32 40.95,33.53 | 44.3,33.27 44.3,32.26 45.52,31.04 51.26,31.04 53.65,33.43
  Bottom 0.61: OUTPUT1.6 53.39,33.48 53.17,33.26 FBD13.2
N$25
  Top 0.61: X4.4 21.18,35.36 17.81,38.73 SER14.2
N$26
  Top 0.61: X4.2 22.1,45.52 22.25,45.62 18.03,45.62 17.32,46.33 SER12.2
N$27
  Top 0.61: POLYFUSE12.1 38.58,36.32 37.8,36.3 38.05,36.32
  Top 1.27: TR-A12.2 38.05,36.32
N$28
  Top 0.61: 22.23,40.36 X4.3 18.37,44.22 SER13.2
N$29
  Top 0.61: TR-A11.2 35.08,45.9 35.28,46.1
  Top 1.27: POLYFUSE11.1 38.2,45.16 37.26,46.1 35.28,46.1
N$30
  Top 0.61: 41.71,52.53 41.73,52.5 PUOR11.1 | 43.59,52.5 LED11.- 43.94,52.76 | 53.67,53.7 53.62,53.75 OUTPUT1.2
  Top 1.27: POLYFUSE11.2 39.42,50.24 41.71,52.53 | PUOR11.1 43.59,52.5 | 43.94,52.76 46.25,50.49 50.52,50.52 53.67,53.7
  Bottom 0.61: 53.47,53.72 OUTPUT1.2 53.31,53.88 FBD11.2
N$31
  Bottom 0.61: ICSP.4 14.96,81.89 14.96,80.77 17.68,78.05 23.93,78.05 | 23.93,78.05 IC1.28 | 23.93,78.05 23.98,78
N$32
  Top 0.61: SER15.2 18.19,33.15 20.96,30.38 21.95,30.38 22.15,30.18 | 22.15,30.18 22.28,30.05 | 22.15,30.18 X4.5
N$33  (via drill 0.6)
  Top 0.61: v47.93,94.72 47.9,94.72 45.59,92.41 43.74,92.41 39.73,96.42 38.74,96.42 35.89,93.57 35.89,96.44 34.72,97.61 25.68,97.61 24.79,96.72 24.79,90.25 25.58,89.46 25.58,74.62 22.23,71.27 20.29,71.27 v20.42,71.22
  Bottom 0.61: 52.15,98.27 52.15,98.25 PUR1.2 | PUR1.2 52.04,98.15 52.04,98.27 54.38,98.27 SER1.2 | C1.1 46.69,93.47 v47.93,94.72 47.9,94.72 | v20.42,71.22 21.08,71.75 23.83,71.75 | 23.83,71.75 23.8,71.73 | 23.83,71.75 IC1.23 | PUR1.2 51.97,97.71 49.81,95.56 48.74,95.56 47.9,94.72 | 47.9,94.72 47.8,94.61
N$35  (via drill 0.6)
  Top 0.61: Q21.2 31.29,68.28 32.97,66.65 35.31,66.65 v35.38,66.73
  Bottom 0.61: IC1.10 34.19,66.65 34.26,66.73 v35.38,66.73
N$36  (via drill 0.6)
  Top 0.61: 3.4,41.3 3.48,41.38 3.58,41.27 TR-A111.1 3.68,41.15 3.51,40.97 v1.73,40.97
  Bottom 0.61: v1.73,40.97 1.02,41.68 1.02,62.35 1.02,62.33 1.02,64.59 | 3.02,60.1 2.94,60.1 SERPDR.1 2.9,60.25 3.12,60.25 3.12,63.04 1.55,64.62 SERSER.2 1.02,64.59 | 1.02,64.59 1.07,64.72
N$37
  Top 0.61: ISCPRES.1 17.45,88.34 17.42,88.32 22.63,83.19 ICSP.1
  Bottom 0.61: IC1.1 34.29,78.11 34.37,78.03 35.13,78.03 36.55,79.45 36.55,82.93 35.66,83.82 35.46,83.82 RESET.2 34.32,83.84 31.39,86.77 23.11,86.82 | 23.11,86.82 23.09,86.82 | ICSP.1 22.68,82.19 22.58,81.92 22.58,86.36 23.04,86.82 23.11,86.82
N$38
  Top 0.61: SERIAL.2 5.84,50.75 6.53,50.06 8.23,50.06 8.86,49.43 8.86,45.52 9.3,45.09 9.3,45.01 9.73,44.58 9.73,39.62 8.66,38.56 6.1,38.56 5.92,38.73 SERPUR.2 5.89,38.81 5.82,38.89 5.99,39.06 TR-A111.2
  Bottom 0.61: 5.97,53.16 SERINV.2 | SERIAL.2 5.94,52.55 5.97,52.53 5.97,53.16 | 5.97,53.16 5.97,53.47
N$39  (via drill 0.6)
  Top 0.61: 35.51,68.02 v35.48,68.22 35.56,68 35.48,68 33.99,69.49 33.99,71.37 33.91,71.45 33.63,74.12 31.14,76.61 Q21.1
  Bottom 0.61: IC1.9 34.16,68 34.14,68.02 34.16,68.05 34.11,68.02 35.28,68.02 v35.48,68.22
N$40
  Bottom 0.61: ICSP.5 12.45,81.94 12.45,79.58 14.28,77.75 15.19,76.81 23.9,76.81 23.93,76.83 | 23.93,76.83 23.95,76.86 | 23.93,76.83 IC1.27
N$41  (via drill 0.6)
  Top 0.61: v9.88,95.25 9.88,95.05 10.47,94.46 10.47,93.14 3.89,86.56 3.89,80.34 10.49,73.74 10.49,70.94 11.43,70 v11.4,65.41 | v27.08,65.2 35.84,65.2 37.69,67.06 37.69,68.61 40.16,71.07 v40.23,70.99
  Bottom 0.61: v9.88,95.25 8.76,96.37 SER10.2 8.76,98.12 8.51,98.37 8.23,98.1 PUR10.2 | v9.88,95.25 11.05,94.08 11.05,93.78 11.17,93.65 | 11.17,93.65 C10.1 | 11.17,93.65 11.17,93.96 v9.88,95.25 | 11.4,65.43 v11.4,65.41 IC1.18 26.98,65.41 v27.08,65.2 | 41.5,70.84 U$1.12 40.39,70.84 v40.23,70.99
N$42
  Bottom 0.61: 13.79,101.29 13.79,101.24 | SER9.1 13.79,101.29 | X3.9 13.79,106.43 13.79,101.29
N$43  (via drill 0.6)
  Top 0.61: v31.75,94.51 29.57,94.51 29.16,94 29.16,75.56 v29.54,75.18
  Bottom 0.61: 31.78,98.27 31.85,98.27 31.85,94.42 C5.1 30.97,93.42 31.78,94.23 31.75,94.61 v31.75,94.51 | 31.78,98.27 31.77,98.27 PUR5.2 | SER5.2 34.09,98.27 31.78,98.27 | v29.54,75.18 30.12,74.24 34.11,74.24 IC1.4 33.83,74.3 33.76,74.37 33.81,74.42 37.14,74.42 37.8,73.76 37.8,68.53 40.77,65.56 44.5,65.56 45.16,66.22 45.16,67.54 44.42,68.28 44.27,68.3 U$1.10
N$44  (via drill 0.6)
  Top 0.61: v14.1,95.25 14.1,92.43 7.24,85.57 7.24,80.95 14.12,74.07 14.1,64.14 14.07,64.11 v14.22,64.11 | v26.64,63.68 36.91,63.68 40.46,67.23 40.46,69.47 40.56,69.57 v40.49,69.57
  Bottom 0.61: PUR9.2 11.35,97.89 11.35,97.87 13.77,97.87 SER9.2 14.12,97.94 14.12,94.47 C9.1 14.63,93.63 14.1,94.16 v14.1,95.25 | 14.12,64.14 IC1.17 26.19,64.14 v26.64,63.68 | v14.22,64.11 14.12,64.11 14.1,64.14 14.12,64.14 | 14.12,64.14 13.03,63.04 13.06,63.04 11.86,61.85 C6SER.1 | v40.49,69.57 U$1.11
N$45  (via drill 0.6)
  Top 0.61: v48.03,65.99 46.81,65.99 46.43,66.37 46.43,77.78 44.83,79.55 44.83,81.28 44.98,81.33 | 44.98,81.33 44.73,81.2 | 44.98,81.33 RS232.2
  Bottom 0.61: U$1.8 48.03,67 v48.03,65.99
N$49
  Bottom 0.61: 43.38,73.38 U$1.14 41.78,73.38 41.1,74.07 41.1,78.11 42.55,79.58 42.55,80.57 42.39,81.31 RS232.3
N$52
  Top 0.61: PUOR15.2 44.02,15.39 44.3,15.67 44.38,15.59 LEDR15.2 44.38,16.33 46.08,18.03 53.42,18.03 53.47,18.09 53.44,18.11 OUTPUT1.9 | 44.6,26.59 44.68,26.52 | 44.6,26.59 LEDR14.2 44.48,26.9 46.3,28.73 53.29,28.73 53.65,28.37 53.62,28.35 OUTPUT1.7 | PUOR14.2 44.58,26.62 44.6,26.59 | 54.46,58.83 OUTPUT1.1 53.47,58.83 53.65,59 53.39,59.26 45.8,59.26 44.02,57.48 LEDR11.2 44.04,55.78 | 57.12,48.64 56.36,48.64 56.34,48.67 | 57.1,38.53 56.36,38.51 | PUOR13.2 43.87,36.93 43.97,36.83 44.04,36.91 LEDR13.2 44.25,37.98 45.11,38.84 | OUTPUT1.5 53.87,38.51 53.9,38.53 53.59,38.84 | 57.15,28.8 56.36,28.8 56.29,28.73 | PUOR12.2 44.07,46.15 44.3,46.38 LEDR12.2 44.45,46.26 | 53.62,48.67 53.67,48.62 | OUTPUT1.3 53.62,48.67 | 53.62,48.67 53.26,48.56 | 44.04,55.78 44.25,55.58 | PUOR11.2 43.92,55.9 44.04,55.78 | SOURCE.2 52.63,64.47 52.68,64.64 52.48,64.62
  Top 1.27: 46.08,18.03 54.86,18.03 57.12,20.34 57.15,28.8 57.1,38.53 57.12,48.64 57.15,56.13 54.46,58.83 | OUTPUT1.1 53.26,58.83 | 56.34,48.67 OUTPUT1.3 | 56.36,38.51 OUTPUT1.5 | 53.59,38.84 45.11,38.84 | 56.29,28.73 46.3,28.73 | 44.45,46.26 47.12,48.56 53.26,48.56 | 53.39,59.26 53.11,58.7 52.68,59.13 52.68,64.64
  Bottom 0.61: 53.59,18.19 53.72,18.06 | 53.59,18.19 OUTPUT1.9 | 53.59,18.19 53.52,18.26 FBD14.1 47.09,18.21 | 53.56,28.36 53.54,28.35 OUTPUT1.7 | 53.56,28.36 FBD13.1 | 53.56,28.36 53.7,28.5 | OUTPUT1.5 53.44,38.56 53.47,38.58 53.4,38.65 FBD12.1 | 53.62,48.67 53.67,48.62 | OUTPUT1.3 53.62,48.67 | FBD11.1 53.3,48.99 53.62,48.67 | FBD15.1 47.19,9.8 45.84,9.8 44.35,11.3 44.35,16.08 46.48,18.21 47.09,18.21 | 47.09,18.21 47.19,18.21
N$55
  Top 0.61: LEDRESMAIN.1 8.64,10.61 8.64,10.62 8.56,10.54 LED200.-
N$60
  Bottom 0.61: U$1.13 41.35,72.11 39.98,73.48 39.98,79.5 39.78,80.42 39.78,81.56 | 39.78,81.56 39.73,81.46 | 39.78,81.56 RS232.4
N$63
  Top 0.61: 6.48,24.33 VR2.1 | 8.64,28.17 8.66,28.14 VR1.1 | 8.76,28.04 8.76,26.62 | 9.04,20.45 9.02,20.47 CMAIN.1
  Top 1.27: 8.76,26.62 6.48,24.33 | 8.66,28.14 8.76,28.04 | VR2.1 6.48,23.01 9.02,20.47
  Bottom 0.61: 57.73,66.95 57.63,66.95 POLYFUSE200.2 57.2,67.06 | 8.69,27.96 VR1.1
  Bottom 1.27: 57.2,67.06 57.2,62.23 56.13,61.19 50.29,61.19 49.78,60.68 43.89,60.68 41.61,58.4 41.61,3.89 39.52,1.8 14.73,1.8 12.8,3.73 12.8,17.48 14.07,18.75 14.07,21.89 8.69,27.28 8.69,27.96
N$71
  Top 0.61: LED15.+ 48.39,11.94 48.41,11.96 47.78,12.6 LEDR15.1
N$72
  Top 0.61: LED14.+ 48.57,23.22 48.59,23.24 47.88,23.95 LEDR14.1
N$73
  Top 0.61: 48.31,33.43 48.34,33.4 | LED13.+ 48.31,33.43 | LEDR13.1 47.65,34.09 48.31,33.43
N$74
  Top 0.61: LED12.+ 48.64,42.85 48.67,42.88 47.85,43.69 LEDR12.1
N$75
  Top 0.61: LEDR11.1 47.42,55.42 47.4,55.4 47.96,54.84 LED11.+
N$77
  Bottom 0.61: 44.3,106.55 44.3,106.68 | 44.3,106.55 X3.3 | SER3.1 44.3,101.6 44.3,106.55
N$80
  Bottom 0.61: U$1.5 48.67,70.84 48.72,70.79 48.77,70.84 RC2.2
N$81
  Bottom 0.61: U$1.3 49.61,73.38 50.22,73.99 50.22,74.4 52.04,76.22 52.15,76.12 RC1.2
N$82
  Bottom 0.61: RC2.1 52.45,73.64 51.82,73.69 50.24,72.11 U$1.4
N$83
  Bottom 0.61: U$1.1 48.54,75.92 51.49,78.87 RC1.1
N$84
  Top 0.61: RC4.1 52.73,81.2 53.9,82.37 54.31,82.22 54.89,82.47 RS232PWR.3
  Bottom 0.61: U$1.2 46.71,74.65 45.95,75.41 45.95,76.4 49.23,79.68 49.66,80.14 52.27,82.5 54.89,82.5 RS232PWR.3
N$85  (via drill 0.6)
  Top 0.61: v50.01,69.57 50.95,69.57 52.3,70.91 RC5.2 50.9,70.91 49.61,72.21 49.61,74.6 | 49.61,74.6 49.61,74.73 | RS232PWR.2 54.89,79.91 53.9,79.83 49.63,75.56 49.63,74.62 49.61,74.6
  Bottom 0.61: U$1.6 v50.01,69.57
N$86
  Bottom 0.61: X3.4 39.24,106.48 39.19,106.48 39.19,101.6 SER4.1
N$87
  Bottom 0.61: 34.16,106.53 34.16,106.76 | 34.16,106.53 X3.5 | SER5.1 34.16,101.6 34.16,106.53
N$88
  Bottom 0.61: 18.9,106.55 18.9,106.76 | 18.9,106.55 X3.8 | SER8.2 18.9,101.52 18.9,106.55
N$89
  Bottom 0.61: 54.53,106.53 54.53,106.63 | 54.53,106.53 X3.1 | SER1.1 54.53,106.53
N$90  (via drill 0.6)
  Top 0.61: PUR11.2 13.46,51.71 13.49,51.74 SER11.1 16.08,51.72 16.08,51.59 17.17,51.59 19.99,48.77 25.07,48.77 27.69,51.38 29.18,51.38 | 33.02,43.59 TR-A11.1 | 33.02,43.59 31.24,45.36 31.24,50.93 30.91,51.26 PDR11.1 29.26,51.38 | 29.18,51.38 29.26,51.38 | 29.18,51.38 29.18,51.41 29.21,51.38 29.26,51.38 | 33.02,43.61 | 33.02,43.59 33.02,43.61 | 33.02,43.61 v33.02,43.64
  Bottom 0.61: IC1.14 33.88,61.59 33.88,44.5 v33.02,43.64
N$91
  Bottom 0.61: 49.48,106.55 49.48,106.68 | 49.48,106.55 X3.2 | SER2.1 49.48,101.6 49.48,106.55
N$92
  Top 0.61: X4.1 22.25,50.6 22.28,50.62 17.76,55.14 SER11.2
N$93  (via drill 0.6)
  Top 0.61: PUR12.2 13.36,46.33 13.74,46.71 13.74,47.24 16.08,49.58 SER12.1 16.18,49.73 18.39,47.52 23.83,47.52 25.6,45.77 25.6,42.88 27.53,40.95 28.3,40.95 | TR-A12.1 33.63,33.98 31.57,36.04 31.57,40.84 31.35,41.07 | 31.35,41.07 31.32,41.1 | 31.35,41.07 PDR12.1 30.1,40.95 | 28.3,40.95 30.07,40.95 | 30.07,40.95 30.1,40.95 | 28.3,40.95 28.3,40.92 28.25,40.97 28.14,40.97 | 30.1,40.95 30.1,40.92 | 30.07,40.95 30.1,40.92 | v30.05,41.81 30.05,40.97 30.1,40.92
  Bottom 0.61: IC1.13 33.4,62.87 32.61,62.08 32.61,45.49 30.07,42.95 30.07,41.83 v30.05,41.81
N$94  (via drill 0.6)
  Top 0.61: 13.21,40.82 13.23,40.79 PUR13.2 | 13.21,40.82 SER13.1 16.08,41 16.05,41.02 16.13,41.1 17.96,41.1 21.08,37.97 24.31,37.97 26.04,36.25 26.04,34.67 27.48,33.22 27.53,33.22 27.56,33.2 27.55,33.19 29.29,31.45 29.64,31.45 | 13.21,40.82 13.13,40.89 | TR-A13.1 33.2,24.21 31.95,25.45 31.95,31.01 31.52,31.45 PDR13.1 29.64,31.45 | v29.59,32.94 29.64,32.89 29.64,31.45
  Bottom 0.61: IC1.12 32.97,64.14 31.04,62.2 31.04,45.85 28.73,43.54 28.73,33.73 29.52,32.94 v29.59,32.94
N$95  (via drill 0.6)
  Top 0.61: v33.76,94.69 33.76,96.55 33.68,96.62 29.01,96.62 28.02,95.63 28.02,74.68 v29.77,72.92
  Bottom 0.61: 36.75,98.12 36.6,98.12 | 36.75,98.12 PUR4.2 36.6,97.97 36.6,96.16 34.87,94.44 34.87,93.65 C4.1 34.54,94.69 v33.76,94.69 | SER4.2 36.75,98.12 | IC1.5 34.19,73 29.85,73 v29.77,72.92
N$97  (via drill 0.6)
  Top 0.61: v39.73,94.34 37.01,91.62 31.78,91.62 30.56,90.4 30.56,84.76 33.5,81.81 33.5,76.45 36.35,73.61 v36.35,72.64 36.35,72.62
  Bottom 0.61: SER3.2 44.14,97.94 41.76,97.94 41.76,98 PUR3.2 41.83,98.07 41.83,96.45 C3.1 v39.72,94.34 v39.73,94.34 | 34.14,71.78 33.86,71.78 | IC1.6 34.14,71.78 | v36.35,72.64 35.43,71.78 34.14,71.78
N$98  (via drill 0.6)
  Top 0.61: PUR14.2 16.08,35.38 SER14.1 16,35.36 | TR-A14.1 33.71,13.54 31.88,15.37 31.88,20.19 PDR14.1 | PDR14.1 31.34,20.73 | PDR14.1 30.45,20.57 26.44,24.59 26.44,30.02 | 26.44,30.02 26.44,31.04 26.44,31.06 24.18,33.33 20.29,33.33 18.26,35.36 16,35.36 | 16,35.36 15.9,35.36 | v27.46,29.95 27.38,30.02 26.44,30.02
  Bottom 0.61: IC1.11 32.59,65.41 29.49,62.31 29.49,46.43 27.46,44.4 v27.46,29.95
N$99  (via drill 0.6)
  Top 0.61: v18.16,74.3 18.16,60.45 v18.11,60.5 | SER16.1 15.88,24.31 | SER16.1 15.95,24.28 PUR16.1 | SER16.1 16.05,24.13 17.5,24.13 18.11,24.74 v18.11,26.29
  Bottom 0.61: IC1.25 v18.16,74.3 18.19,74.3 18.24,74.35 14.86,74.35 B4SER.2 | v18.11,60.5 18.57,59.61 18.57,26.31 18.49,26.29 18.47,26.29 | 18.47,26.29 18.44,26.31 | v18.11,26.29 18.47,26.29
N$100
  Top 0.61: X4.9 22.12,9.96 22.02,9.86 20.96,10.92 SER19.2
N$101  (via drill 0.6)
  Top 0.61: PUR15.1 16.18,29.85 16.21,29.82 16.13,29.75 SER15.1 18.52,29.72 v20.5,27.74 20.35,27.79 24.23,27.79 25.3,26.72 25.3,10.62 26.7,9.22 PDR15.1 | PDR15.1 30.99,9.22 | PDR15.1 31.22,8.82 31.22,4.27 33.17,2.31 35.38,2.31 TR-A15.1
  Bottom 0.61: 20.68,27.79 v20.5,27.74 20.5,27.86 | IC1.7 34.19,70.48 34.21,70.46 33.1,70.46 32.99,70.36 32.97,70.36 31.32,68.71 31.32,65.73 25.6,59.99 25.6,28.68 24.71,27.79 20.68,27.79 | 20.68,27.79 20.5,27.79 20.5,27.86 | 20.5,27.86 20.47,27.76
N$102
  Top 0.61: X4.8 22.15,14.96 20.6,16.51 SER18.2
N$104
  Bottom 0.61: SERINV.1 5.97,61.59 | 5.97,61.59 5.97,63.73 | 5.97,63.73 5.97,63.8 | 5.97,61.59 5.94,61.59 | 5.97,61.59 C6SER.2 | B4SER.1 10.44,72.97 10.44,69.29 5.99,64.85 5.99,64.69 | 5.97,63.73 5.99,63.73 5.99,64.69 | 5.99,64.69 5.92,64.69 5.84,64.62 SERSER.1
N$106
  Bottom 0.61: X3.6 29.16,106.55 29.18,106.55 29.18,101.6 SER6.1
N$107  (via drill 0.6)
  Top 0.61: v26.57,72.59 v26.57,95.22
  Bottom 0.61: 26.47,98.2 26.47,98.27 | 26.47,98.2 PUR6.2 26.59,98.12 SER6.2 | 26.47,98.2 26.47,93.73 C6.1 26.67,95.12 v26.57,95.22 | v26.57,72.59 26.57,71.42 25.58,70.43 23.9,70.43 23.85,70.48 IC1.22
N$108
  Bottom 0.61: SER7.2 24.08,101.47 24.08,107.11 24.21,106.98 24.21,106.32 | 24.21,106.32 24.21,106.22 | 24.21,106.32 X3.7
N$109
  Bottom 0.61: 8.76,101.17 SER10.1 8.76,106.48 X3.10
N$111  (via drill 0.6)
  Top 0.61: v21.49,95.38 21.54,98.93 20.35,99.08 16.74,99.06 13.28,98.75 12.17,96.62 12.17,92.61 5.69,86.13 5.69,80.52 12.65,73.56 12.65,70.97 v12.62,71.02
  Bottom 0.61: 21.56,98.17 21.56,98.27 | 21.56,98.17 PUR7.2 21.41,98.02 | 21.56,98.17 21.56,94.52 C7.1 22.22,93.58 21.64,94.16 21.64,95.22 v21.49,95.38 | 21.41,98.02 21.31,98.02 | SER7.1 21.41,98.02 | IC1.24 20.24,73.03 18.42,71.2 12.78,71.2 12.6,71.02 | 12.57,70.99 12.6,71.02 | 12.6,71.02 v12.62,71.02
SER18  (via drill 0.6)
  Top 0.61: PUR18.1 15.52,13.23 15.64,13.11 SER18.1 16.99,13.11 v14.68,13.34 | v12.45,59.28 43.21,59.28 45.19,61.27 45.19,76.66 42.77,79.07 v37.97,79.07 37.9,79.07
  Bottom 0.61: 13.11,30.68 6.63,30.68 6.02,31.29 6.02,33.58 IN/OUT/OW.2 | v14.68,13.34 15.21,13.36 15.9,14.1 15.9,22.76 13.13,25.53 13.11,30.68 | 37.95,78.94 37.9,78.99 37.95,79.05 | U$1.9 41.05,67.03 38.91,69.16 38.91,74.55 37.87,75.59 | IC1.3 37.87,75.56 37.87,75.59 | v37.97,79.07 37.95,79.05 | 37.87,75.59 37.87,78.97 37.95,79.05 | v12.45,59.28 12.37,59.28 12.37,59.33 13.11,59.33 13.11,30.68

### Text on the board
tPlace: General I/O Mini August 2011 Dan Jubenville | R1 | T1 | T2 | R2 | - | + | - | + | + | -
bPlace: R1 | T1 | T2 | R2 | - | + | 5V | 18V | General I/O Mini August 2011 Dan Jubenville | - | + | + | -